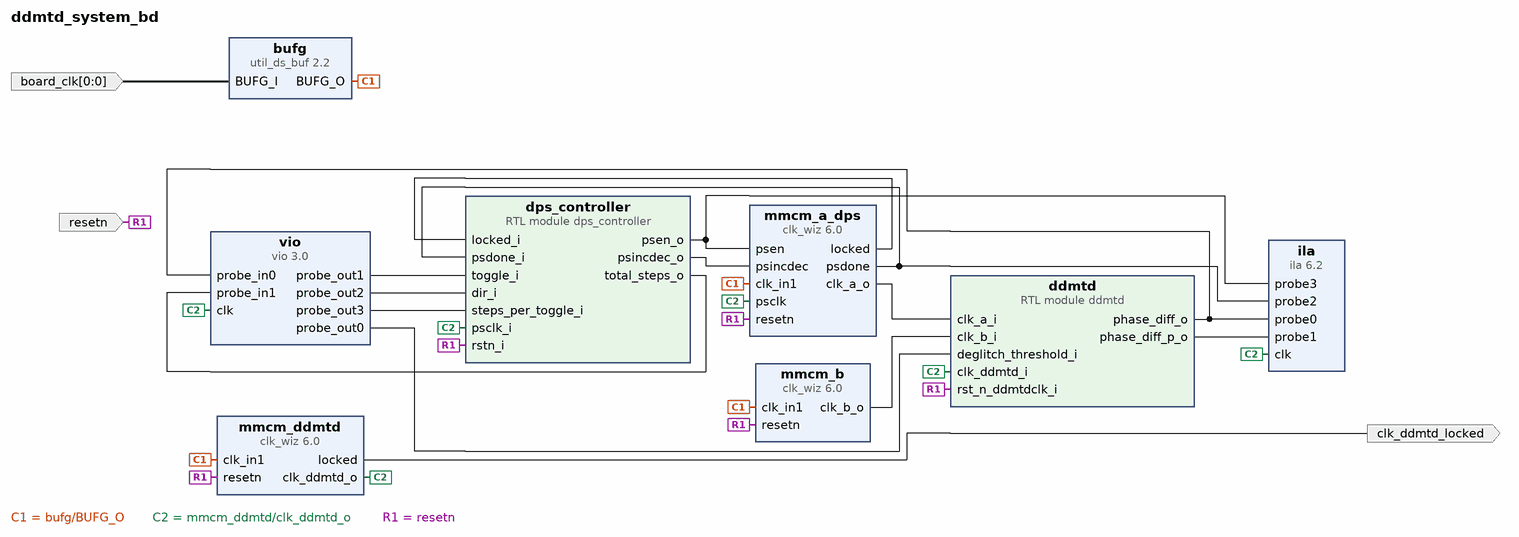
[diagram p0: block diagram of the top level]
# Vivado block design ddmtd_system_bd, xc7z020clg484-1, Vivado 2025.1
create_bd_design ddmtd_system_bd

create_bd_port -dir I -from 0 -to 0 -type clk board_clk
create_bd_port -dir I -type rst resetn
create_bd_port -dir O clk_ddmtd_locked

create_bd_cell -type ip -vlnv xilinx.com:ip:clk_wiz:6.0 mmcm_a_dps
set_property -dict [list \
  CONFIG.CLKOUT1_DRIVES BUFG \
  CONFIG.CLKOUT1_JITTER 125.247 \
  CONFIG.CLKOUT1_REQUESTED_OUT_FREQ 125.000 \
  CONFIG.CLKOUT2_DRIVES BUFG \
  CONFIG.CLKOUT3_DRIVES BUFG \
  CONFIG.CLKOUT4_DRIVES BUFG \
  CONFIG.CLKOUT5_DRIVES BUFG \
  CONFIG.CLKOUT6_DRIVES BUFG \
  CONFIG.CLKOUT7_DRIVES BUFG \
  CONFIG.CLK_OUT1_PORT clk_a_o \
  CONFIG.MMCM_CLKFBOUT_USE_FINE_PS true \
  CONFIG.MMCM_CLKOUT0_DIVIDE_F 8.000 \
  CONFIG.OVERRIDE_MMCM true \
  CONFIG.PRIM_SOURCE Global_buffer \
  CONFIG.RESET_PORT resetn \
  CONFIG.RESET_TYPE ACTIVE_LOW \
  CONFIG.SECONDARY_SOURCE Single_ended_clock_capable_pin \
  CONFIG.USE_DYN_PHASE_SHIFT true \
  CONFIG.USE_PHASE_ALIGNMENT false \
] [get_bd_cells mmcm_a_dps]
create_bd_cell -type ip -vlnv xilinx.com:ip:clk_wiz:6.0 mmcm_b
set_property -dict [list \
  CONFIG.CLKOUT1_DRIVES BUFG \
  CONFIG.CLKOUT1_JITTER 125.247 \
  CONFIG.CLKOUT1_REQUESTED_OUT_FREQ 125.000 \
  CONFIG.CLKOUT2_DRIVES BUFG \
  CONFIG.CLKOUT3_DRIVES BUFG \
  CONFIG.CLKOUT4_DRIVES BUFG \
  CONFIG.CLKOUT5_DRIVES BUFG \
  CONFIG.CLKOUT6_DRIVES BUFG \
  CONFIG.CLKOUT7_DRIVES BUFG \
  CONFIG.CLK_OUT1_PORT clk_b_o \
  CONFIG.MMCM_CLKOUT0_DIVIDE_F 8.000 \
  CONFIG.PRIM_SOURCE Global_buffer \
  CONFIG.RESET_PORT resetn \
  CONFIG.RESET_TYPE ACTIVE_LOW \
  CONFIG.SECONDARY_SOURCE Single_ended_clock_capable_pin \
  CONFIG.USE_PHASE_ALIGNMENT false \
] [get_bd_cells mmcm_b]
create_bd_cell -type ip -vlnv xilinx.com:ip:clk_wiz:6.0 mmcm_ddmtd
set_property -dict [list \
  CONFIG.CLKOUT1_DRIVES BUFG \
  CONFIG.CLKOUT1_JITTER 197.421 \
  CONFIG.CLKOUT1_PHASE_ERROR 301.537 \
  CONFIG.CLKOUT1_REQUESTED_OUT_FREQ 125.06667 \
  CONFIG.CLKOUT2_DRIVES BUFG \
  CONFIG.CLKOUT3_DRIVES BUFG \
  CONFIG.CLKOUT4_DRIVES BUFG \
  CONFIG.CLKOUT5_DRIVES BUFG \
  CONFIG.CLKOUT6_DRIVES BUFG \
  CONFIG.CLKOUT7_DRIVES BUFG \
  CONFIG.CLK_OUT1_PORT clk_ddmtd_o \
  CONFIG.MMCM_CLKFBOUT_MULT_F 58.625 \
  CONFIG.MMCM_CLKOUT0_DIVIDE_F 9.375 \
  CONFIG.MMCM_DIVCLK_DIVIDE 5 \
  CONFIG.PRIM_SOURCE Global_buffer \
  CONFIG.RESET_PORT resetn \
  CONFIG.RESET_TYPE ACTIVE_LOW \
  CONFIG.SECONDARY_SOURCE Single_ended_clock_capable_pin \
  CONFIG.USE_PHASE_ALIGNMENT false \
] [get_bd_cells mmcm_ddmtd]
create_bd_cell -type module -reference dps_controller dps_controller
create_bd_cell -type module -reference ddmtd ddmtd
create_bd_cell -type ip -vlnv xilinx.com:ip:util_ds_buf:2.2 bufg
set_property -dict {CONFIG.C_BUF_TYPE BUFG} [get_bd_cells bufg]
create_bd_cell -type ip -vlnv xilinx.com:ip:ila:6.2 ila
set_property -dict [list \
  CONFIG.C_DATA_DEPTH 65536 \
  CONFIG.C_EN_STRG_QUAL 1 \
  CONFIG.C_MONITOR_TYPE Native \
  CONFIG.C_NUM_OF_PROBES 4 \
  CONFIG.C_PROBE0_WIDTH 16 \
] [get_bd_cells ila]
create_bd_cell -type ip -vlnv xilinx.com:ip:vio:3.0 vio
set_property -dict [list \
  CONFIG.C_NUM_PROBE_IN 2 \
  CONFIG.C_NUM_PROBE_OUT 4 \
  CONFIG.C_PROBE_IN0_WIDTH 16 \
  CONFIG.C_PROBE_IN1_WIDTH 16 \
  CONFIG.C_PROBE_OUT0_WIDTH 16 \
  CONFIG.C_PROBE_OUT3_WIDTH 8 \
] [get_bd_cells vio]

# ---- connections ----

connect_bd_net -net BUFG_I_0_1 [get_bd_ports board_clk] [get_bd_pins bufg/BUFG_I]
connect_bd_net [get_bd_pins bufg/BUFG_O] [get_bd_pins mmcm_a_dps/clk_in1] [get_bd_pins mmcm_b/clk_in1] [get_bd_pins mmcm_ddmtd/clk_in1]
connect_bd_net [get_bd_pins ddmtd/phase_diff_o] [get_bd_pins ila/probe0] [get_bd_pins vio/probe_in0]
connect_bd_net [get_bd_pins ddmtd/phase_diff_p_o] [get_bd_pins ila/probe1]
connect_bd_net -net dps_controller_psen [get_bd_pins dps_controller/psen_o] [get_bd_pins mmcm_a_dps/psen] [get_bd_pins ila/probe3]
connect_bd_net -net dps_controller_psincdec [get_bd_pins dps_controller/psincdec_o] [get_bd_pins mmcm_a_dps/psincdec]
connect_bd_net -net dps_controller_total_steps [get_bd_pins dps_controller/total_steps_o] [get_bd_pins vio/probe_in1]
connect_bd_net [get_bd_pins mmcm_a_dps/clk_a_o] [get_bd_pins ddmtd/clk_a_i]
connect_bd_net [get_bd_pins mmcm_a_dps/locked] [get_bd_pins dps_controller/locked_i]
connect_bd_net [get_bd_pins mmcm_a_dps/psdone] [get_bd_pins ila/probe2] [get_bd_pins dps_controller/psdone_i]
connect_bd_net [get_bd_pins mmcm_b/clk_b_o] [get_bd_pins ddmtd/clk_b_i]
connect_bd_net [get_bd_pins mmcm_ddmtd/clk_ddmtd_o] \
  [get_bd_pins ddmtd/clk_ddmtd_i] [get_bd_pins ila/clk] [get_bd_pins vio/clk] [get_bd_pins mmcm_a_dps/psclk] \
  [get_bd_pins dps_controller/psclk_i]
connect_bd_net [get_bd_pins mmcm_ddmtd/locked] [get_bd_ports clk_ddmtd_locked]
connect_bd_net -net resetn_0_1 [get_bd_ports resetn] \
  [get_bd_pins mmcm_a_dps/resetn] [get_bd_pins mmcm_b/resetn] [get_bd_pins dps_controller/rstn_i] \
  [get_bd_pins mmcm_ddmtd/resetn] [get_bd_pins ddmtd/rst_n_ddmtdclk_i]
connect_bd_net [get_bd_pins vio/probe_out0] [get_bd_pins ddmtd/deglitch_threshold_i]
connect_bd_net [get_bd_pins vio/probe_out1] [get_bd_pins dps_controller/toggle_i]
connect_bd_net [get_bd_pins vio/probe_out2] [get_bd_pins dps_controller/dir_i]
connect_bd_net [get_bd_pins vio/probe_out3] [get_bd_pins dps_controller/steps_per_toggle_i]

validate_bd_design
save_bd_design
